# EAGLE design v1 (EAGLE 7.3.0)
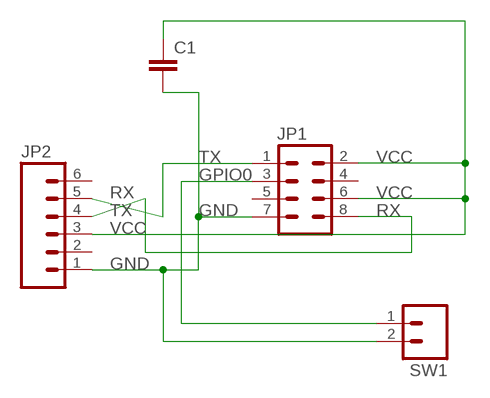
[diagram p0: schematic, sheet 1]

## Parts
C1  CAP0805  [0805]
JP1  M04X2  [2X4]
JP2  M06SILK_FEMALE_PTH  [1X06]
SW1  M02PTH  [1X02]

## Nets
GND: C1.2 JP1.7 JP2.1 SW1.2
GPIO0: JP1.3 SW1.1
RX: JP1.8 JP2.4
TX: JP1.1 JP2.5
VCC: C1.1 JP1.2 JP1.6 JP2.3
Unconnected: JP1.4 JP1.5 JP2.2 JP2.6

## Library data of the parts
C1 = SparkFun-Passives:CAP: Capacitor Standard 0603 ceramic capacitor, and 0.1" leaded capacitor.
JP1 = SparkFun-Connectors:M04X2: .1" header, two rows of four.
JP2 = SparkFun-Connectors:M06: Header 6 Standard 6-pin 0.1" header. Use with straight break away headers (SKU : PRT-00116), right angle break away headers (PRT-00553), swiss pins (PRT-00743), machine pins (PRT-00117), and female headers (PRT-00115). Molex polarized connector foot print use with SKU : PRT-08094 with associated crimp pins and housings. NOTES ON THE VARIANTS LOCK and LOCK_LONGPADS... This footprint was designed to help hold the alignment of a through-hole component (i.e. 6-pin header) while soldering it into place. You may notice that each hole has been shifted either up or down by 0.005 of an inch from it's more standard position (which is a perfectly straight line). This slight alteration caused the pins (the squares in the middle) to touch the edges of the holes. Because they are alternating, it causes a "brace" to hold the component in place. 0.005 has proven to be the perfect amount of "off-center" position when using our standard breakaway headers. Although looks a little odd when you look at the bare footprint, once you have a header in there, the alteration is very hard to notice. Also,if you push a header all the way into place, it is covered up entirely on the bottom side. This idea of altering the position of holes to aid alignment will be further integrated into the Sparkfun Library for other footprints. It can help hold any component with 3 or more connection pins.; PROD_ID: CONN-08437
SW1 = SparkFun-Connectors:M02: Standard 2-pin 0.1" header. Use with - straight break away headers ( PRT-00116) - right angle break away headers (PRT-00553) - swiss pins (PRT-00743) - machine pins (PRT-00117) - female headers (PRT-00115) Molex polarized connector foot print use with: PRT-08233 with associated crimp pins and housings. 2.54_SCREWTERM for use with PRT-10571. 3.5mm Screw Terminal footprints for PRT-08084 5mm Screw Terminal footprints for use with PRT-08432

## Board
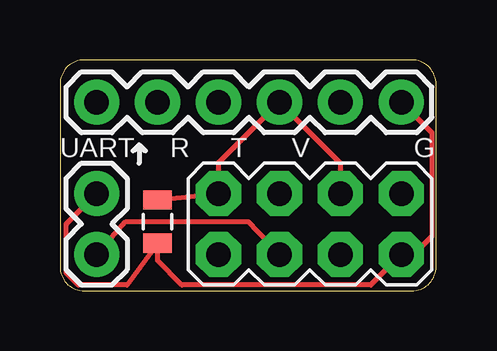
[diagram p1: board, top side]
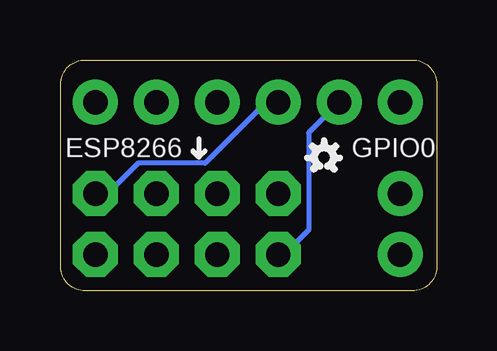
[diagram p2: board, bottom side, seen from below]

Size 15.67 x 9.64 mm. Coordinates in mm from the lower left corner, seen from the top.
Outline: 0,8.63 0,1.02 arc90 1.02,0 14.66,0 arc90 15.67,1.02 15.67,8.63 arc90 14.66,9.64 1.02,9.64 arc90 0,8.63
Copper layers (1*16): Top 0.035mm / dielectric 1.5mm / Bottom 0.035mm
Design rules "default": minimum track width 10mil, minimum drill 24mil, track to track 8mil, track to pad 8mil, pad to pad 8mil, via to via 8mil, smd to smd 8mil, copper to edge 40mil, drill to drill 8mil, minimum pad ring 10mil, minimum via ring 8mil, stop-mask expansion 4mil, vias tented up to drill 0mil, thermal gap 10mil

### Footprints (pad centres in the part's own frame; a part is rotated, then mirrored left to right if it is on the bottom)
0805 = smd 0.8 x 1.2: 1 -0.9,0; 2 0.9,0
2X4 = drill 1.016 pad 1.88 octagon: 1 -3.81,-1.27; 2 -3.81,1.27; 3 -1.27,-1.27; 4 -1.27,1.27; 5 1.27,-1.27; 6 1.27,1.27; 7 3.81,-1.27; 8 3.81,1.27
1X06 = drill 1.016 pad 1.88: 1 0,0; 2 2.54,0; 3 5.08,0; 4 7.62,0; 5 10.16,0; 6 12.7,0
1X02 = drill 1.016 pad 1.88: 1 0,0; 2 2.54,0

### Placement (x,y rotation side)
C1  4.06,2.9 270 top
JP1  10.41,2.79 0 top
JP2  14.22,7.87 180 top
SW1  1.52,1.52 90 top

### Tracks (layer width: path | path; a pad name or v marks a point on that pad's centre or on a via)
GND
  Top 0.203: JP2.1 15.49,6.6 15.49,2.29 14.73,1.52 JP1.7 12.95,0.25 5.08,0.25 4.06,1.27 C1.2 2.79,0.25 0.76,0.25 0.25,0.76 0.25,2.79 SW1.2
GPIO0
  Top 0.203: SW1.1 2.74,2.9 7.82,2.9 JP1.3
RX
  Bottom 0.2: JP2.4 7.11,7.87 7.87,7.11
  Bottom 0.203: 7.87,7.11 9.65,5.33 12.45,5.33 13.72,4.06 JP1.8
TX
  Bottom 0.2: JP2.5 5.33,6.6
  Bottom 0.203: 5.33,6.6 5.33,2.54 6.35,1.52 JP1.1
VCC
  Top 0.203: JP1.6 11.68,5.33 JP2.3 6.6,5.33 JP1.2 C1.1

### Text on the board
tPlace: UART | R | T | V | G
bPlace: GPIO0 | ESP8266